# Altium schematic sheet Sheet2.SchDoc
size A4
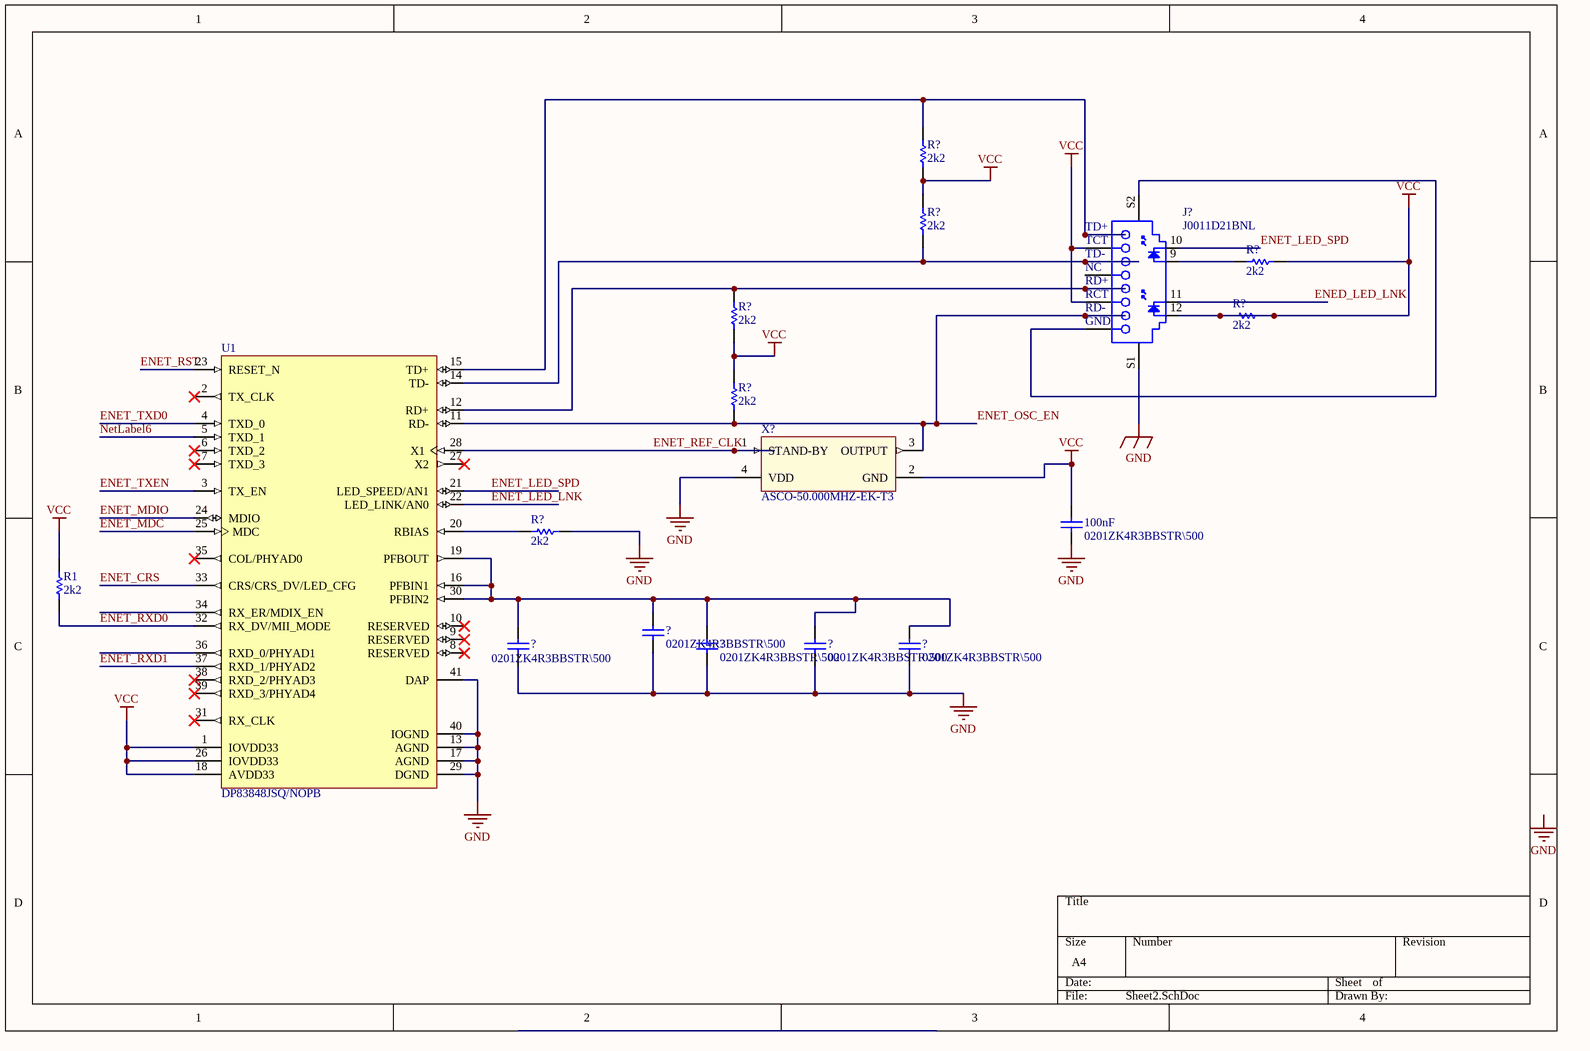
[diagram p0: Sheet2.SchDoc]

## Parts
(Parts that share a designator on the sheet are numbered #1, #2 ... from top to bottom, then left to right.)
100nF  0201ZK4R3BBSTR\500  [CAPC0603X28X15LL05T05]
?#1  0201ZK4R3BBSTR\500  [CAPC0603X28X15LL05T05]
?#2  0201ZK4R3BBSTR\500  [CAPC0603X28X15LL05T05]
?#3  0201ZK4R3BBSTR\500  [CAPC0603X28X15LL05T05]
?#4  0201ZK4R3BBSTR\500  [CAPC0603X28X15LL05T05]
?#5  0201ZK4R3BBSTR\500  [CAPC0603X28X15LL05T05]
J?  J0011D21BNL  [PULS-J00XXD21XNL-B-12]
R1  2k2  [RESC0201(0603)_L]
R?#1  2k2  [RESC0201(0603)_L]
R?#2  2k2  [RESC0201(0603)_L]
R?#3  2k2  [RESC0201(0603)_L]
R?#4  2k2  [RESC0201(0603)_L]
R?#5  2k2  [RESC0201(0603)_L]
R?#6  2k2  [RESC0201(0603)_L]
R?#7  2k2  [RESC0201(0603)_L]
U1  DP83848JSQ/NOPB  [RTA0040A_V]
X?  ASCO-50.000MHZ-EK-T3  [ABRA-ASCO-50.000MHZ-EK-T3-4_V]

## Nets
GND: 100nF.1 ?#1.1 ?#2.1 ?#3.1 ?#4.1 ?#5.1 J?.S1 R?#7.1 U1.13(AGND) U1.17(AGND) U1.29(DGND) U1.40(IOGND) U1.41(DAP) X?.4(VDD)
VCC: 100nF.2 J?.4(TCT) J?.5(RCT) J?.12 R1.1 R?#1.2 R?#2.1 R?#3.1 R?#4.2 R?#5.1 R?#5.2 R?#6.1 U1.1(IOVDD33) U1.18(AVDD33) U1.26(IOVDD33) X?.2(GND)
ENED_LED_LNK: J?.11
ENET_CRS: U1.33(CRS/CRS_DV/LED_CFG)
ENET_LED_LNK: U1.22(LED_LINK/AN0)
ENET_LED_SPD: J?.10 U1.21(LED_SPEED/AN1)
ENET_MDC: U1.25(MDC)
ENET_MDIO: U1.24(MDIO)
ENET_OSC_EN: J?.6(RD-) R?#6.2 U1.11(RD-) X?.3(OUTPUT)
ENET_REF_CLK: U1.28(X1) X?.1(STAND-BY)
ENET_RST: U1.23(RESET_N)
ENET_RXD0: R1.2 U1.32(RX_DV/MII_MODE)
ENET_RXD1: U1.37(RXD_1/PHYAD2)
ENET_TXD0: U1.4(TXD_0)
ENET_TXEN: U1.3(TX_EN)
NetLabel6: U1.5(TXD_1)
Net?#1_2: ?#1.2 ?#2.2 ?#3.2 ?#4.2 ?#5.2 U1.16(PFBIN1) U1.19(PFBOUT) U1.30(PFBIN2)
NetJ?_1: J?.1(TD+) R?#1.1 U1.15(TD+)
NetJ?_2: J?.2(TD-) R?#2.2 U1.14(TD-)
NetJ?_3: J?.3(RD+) R?#4.1 U1.12(RD+)
NetJ?_8: J?.8(CHS_GROUND) J?.S2
NetJ?_9: J?.9 R?#3.2
NetR?#7_2: R?#7.2 U1.20(RBIAS)

Not connected (* = marked no-connect by the designer): J? 7(NC); U1 2(TX_CLK)* 6(TXD_2)* 7(TXD_3)* 8(RESERVED)* 9(RESERVED)* 10(RESERVED)* 27(X2)* 31(RX_CLK)* 34(RX_ER/MDIX_EN) 35(COL/PHYAD0)* 36(RXD_0/PHYAD1) 38(RXD_2/PHYAD3)* 39(RXD_3/PHYAD4)*

## Notes on the sheet
- Labels drawn without touching a wire or pin: GND
- (in symbol CMP-2000-05321-1) GND

## Library data of the parts
100nF ?#1-?#5 = CMP-2010-02256-1: C5; Manufacturer: AVX Interconnect / Elco; Part Number: 0201ZK4R3BBSTR\500
J? = CMP-2000-05321-1: 10/100 Base-TX RJ45 1 x 1 Tab-Down with LEDs Integrated Magnetics Connector, 0 to 70 degC, 12-Pin THD, RoHS, Tube; Manufacturer: Pulse; Body Orientation: RightAngle; Number of Contacts: 8; Gender: F; Pitch: 2.54mm; Category: ConnectorTelephoneandTelecom; Package Description: 12-Pin Through Hole Device, Body 16.26 x 21.59 mm, Pitch 1.27 mm; Datasheet Version: Rev. D, 05/2006; Termination Method: Solder; Type: RJ-45; Package Reference: J0011D21BNL; Manufacturer URL: http://www.pulseelectronics.com/; Mounting: ThroughHole; Datasheet URL: http://datasheet.octopart.com/J0011D21BNL-Pulse-datasheet-120436.pdf
R1 R?#1-R?#7 = CMP-1591-00003-1: 0201 (0603 Metric) Chip Resistor; Case-Metric: 0603; Case-EIA: 0201; PackageReference: RESC0201(0603)
U1 = CMP-0058-00387-4: PHYTER® Mini LS Commercial Temperature Single Port 10/100 Mb/s Ethernet Transceiver, 40-pin LLP, Pb-Free, 250 Reel; Manufacturer: Texas Instruments; PowerWise: N; CompType: Interface IC; PackageTopMarking: NS*UZXYTTE#*83848JSQ; High-Reliability: Y; ComponentLink1URL: http://www.ti.com/general/docs/lit/getliterature.tsp?genericPartNumber=DP83848J&fileType=pdf; PackageReference: RTA0040A; RoHS: Y; PinCount: 40; PartNumber: DP83848JSQ/NOPB; ComponentLink1Description: Datasheet URL; PackageDescription: LLP, Quad, 6 x 6 x 0.8mm, 40 Lead, Small DAP, 0.5mm Pitch, No Pullback
X? = CMP-0461-00001-3: Crystal Clock Oscillator, 50 MHz, -20 to 70 degC, 1.6 x 1.2 x 0.7 mm SMD; Manufacturer: Abracon; Frequency(MHz): 50; Aging: -3 to 3 3 ppm; Packing: Tape and Reel; Overall Frequency Stability: +/-30 ppm; Supply Current (Idd)
into 15pF Load: 6 mA; Supply Voltage (Vdd): 3.3 V; Output Load: 15 pF; ComponentLink2Description: Datasheet; ComponentLink3Description: Package Specification; ComponentLink3URL: http://www.abracon.com/Oscillators/ASCO.pdf; ComponentLink2URL: http://www.abracon.com/Oscillators/ASCO.pdf; Mounting Technology: Surface Mount; PackageDescription: 4-Pin Hand Drawn, Body 1.6 x 1.2 mm; DatasheetVersion: 01.25.13; ComponentLink1Description: Manufacturer URL; PartNumber: ASCO-50.000MHZ-EK-T3; Operating temperature: -20 to 70 degC; ComponentLink1URL: http://www.abracon.com; PackageReference: ASCO-50.000MHZ-EK-T3-4